# EAGLE board ADK_MEGA_2560-REV3 (EAGLE 7.1.0)
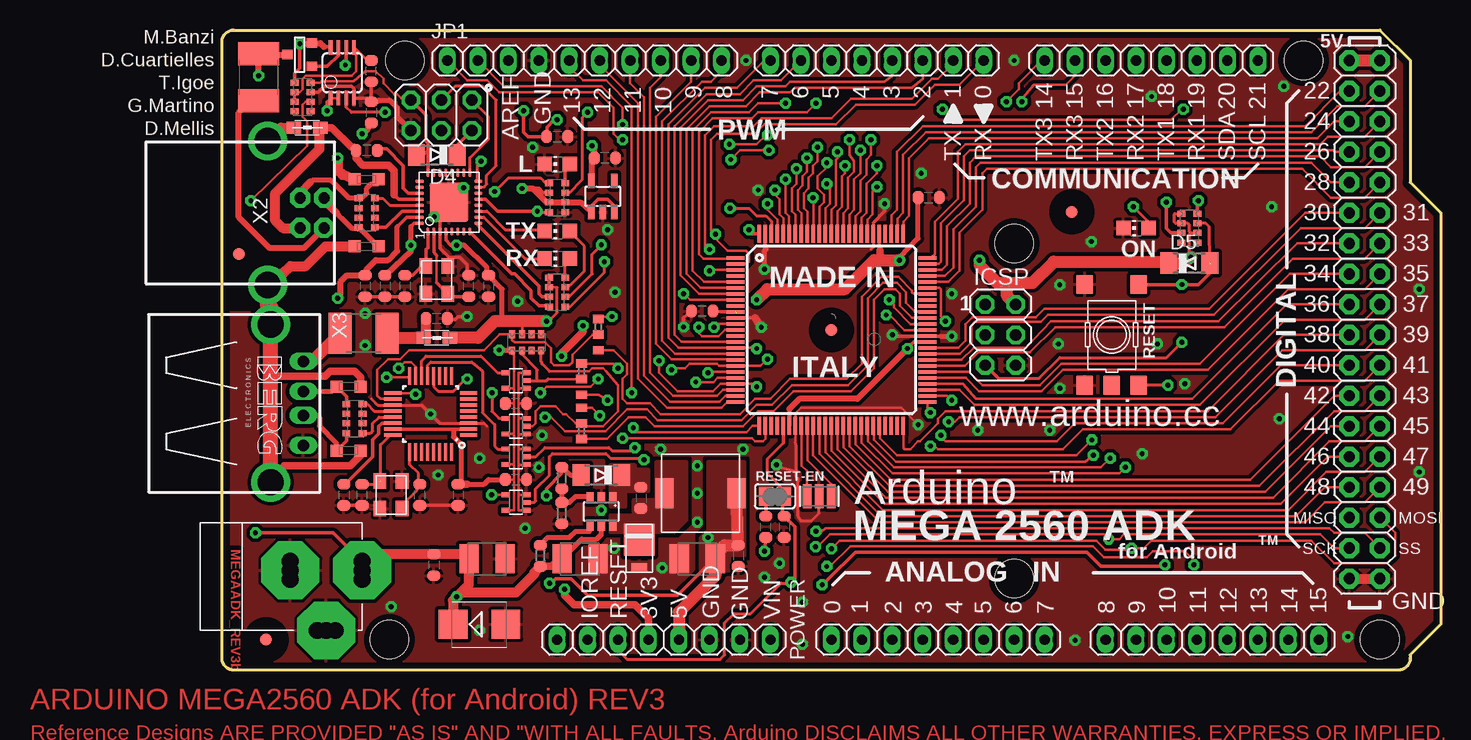
[diagram p2: board, top side]
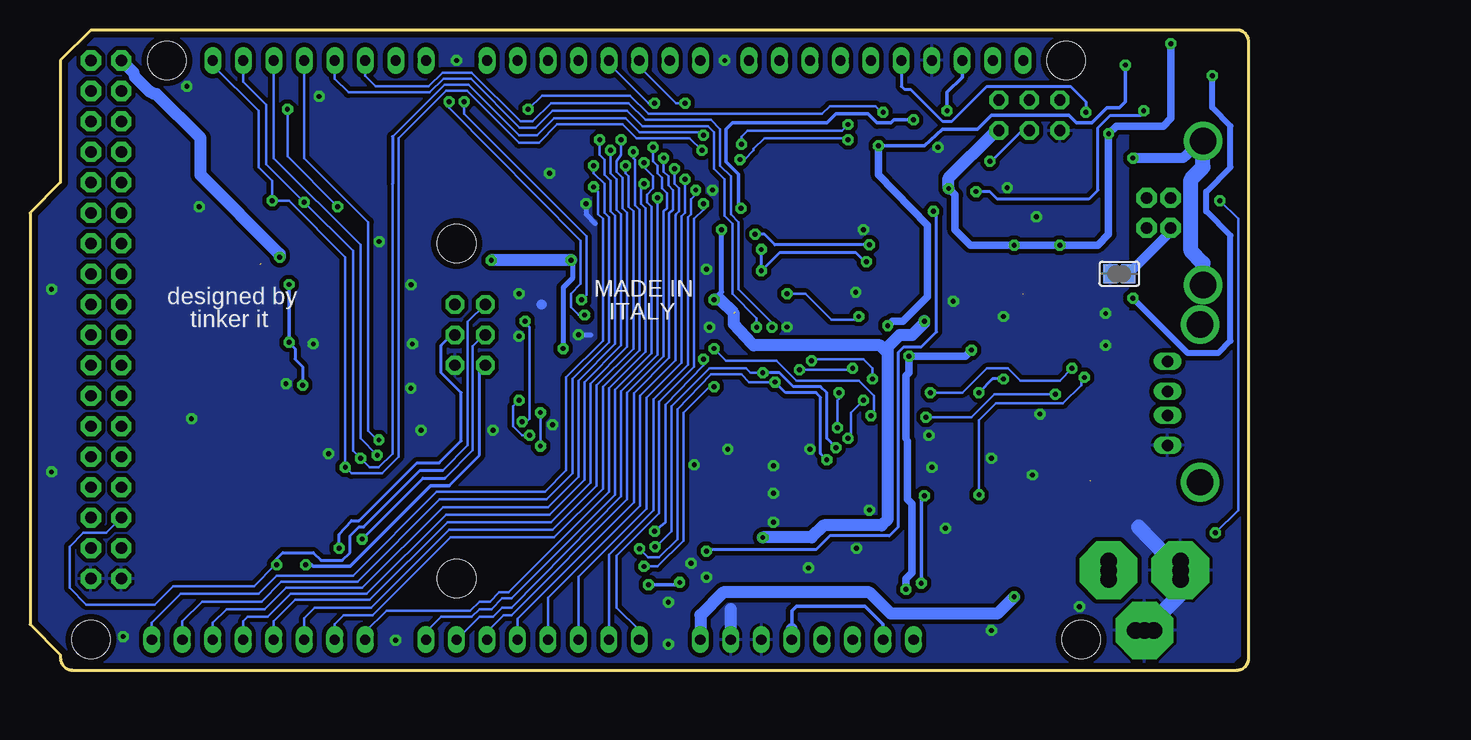
[diagram p3: board, bottom side, seen from below]

Size 101.6 x 53.34 mm. Coordinates in mm from the lower left corner, seen from the top.
Outline: 96.52,53.34 99.06,50.8 99.06,40.64 101.6,38.1 101.6,3.81 99.06,1.27 99.06,1 arc-90 98.06,0 1,0 arc-90 0,1 0,52.34 arc-90 1,53.34 96.52,53.34
Copper layers (1*16): Top 0.035mm / dielectric 1.5mm / Bottom 0.035mm
Design rules "ArduinoMegaHOST *": minimum track width 8mil, minimum drill 16mil, track to track 7mil, track to pad 7mil, pad to pad 7mil, via to via 10mil, smd to smd 7mil, copper to edge 20mil, drill to drill 12mil, minimum pad ring 10mil, minimum via ring 10mil, stop-mask expansion 2mil, vias tented up to drill 20mil, thermal gap 10mil
Net classes: 0 default: width 0.203 mm, drill 0.406 mm, clearance 0.178 mm; 1 power: width 0.305 mm, drill 0.406 mm, clearance 0.178 mm; 2 gnd: width 0.305 mm, drill 0.406 mm, clearance 0.178 mm; 3 power usb: width 0.508 mm, drill 0.406 mm, clearance 0.178 mm
Holes 3.2 mm at 96.52,2.54 15.24,50.8 90.17,50.8 13.97,2.54 66.04,35.56 66.04,7.62

## Footprints (pad centres in the part's own frame; a part is rotated, then mirrored left to right if it is on the bottom)
1X08 = drill 0.85 pad 1.422 long: 1 -8.89,0; 2 -6.35,0; 3 -3.81,0; 4 -1.27,0; 5 1.27,0; 6 3.81,0; 7 6.35,0; 8 8.89,0
C0603-ROUND = smd 0.898 x 1.1: 1 -0.889,0; 2 0.889,0
SMC_B = smd 1.6 x 2.4: + -1.5,0; - 1.5,0
MINIMELF = smd 1.4 x 1.8: A 1.7,0; C -1.7,0
SMB = smd 2.4 x 2.4: A 2.2,0; C -2.2,0
DO220AAL = smd 2.667 x 2.54: P$1 -0.7,0 | smd 0.762 x 1.27: P$2 1.65,0
L1812 = smd 1.9 x 3.4: 1 -1.95,0; 2 1.95,0
FIDUCIA-MOUNT = smd 1.016 x 1.016: P$1 0,0
SJ = smd 1.168 x 1.6: 1 -0.762,0; 2 0.762,0
MSOP08 = smd 0.3 x 1.2: 1 -0.976,-2.113; 2 -0.326,-2.113; 3 0.324,-2.113; 4 0.974,-2.113; 5 0.974,2.112; 6 0.324,2.112; 7 -0.326,2.112; 8 -0.976,2.112
SOT23-6 = smd 0.6 x 0.9: 1 -0.95,-1.15; 2 0,-1.15; 3 0.95,-1.15; 4 0.95,1.15; 5 0,1.15; 6 -0.95,1.15
TQFP100 = smd 1.5 x 0.3: 1 -8,6; 2 -8,5.5; 3 -8,5; 4 -8,4.5; 5 -8,4; 6 -8,3.5; 7 -8,3; 8 -8,2.5; 9 -8,2; 10 -8,1.5; 11 -8,1; 12 -8,0.5; 13 -8,0; 14 -8,-0.5; 15 -8,-1; 16 -8,-1.5; 17 -8,-2; 18 -8,-2.5; 19 -8,-3; 20 -8,-3.5; 21 -8,-4; 22 -8,-4.5; 23 -8,-5; 24 -8,-5.5; 25 -8,-6; 51 8,-6; 52 8,-5.5; 53 8,-5; 54 8,-4.5; 55 8,-4; 56 8,-3.5; 57 8,-3; 58 8,-2.5; 59 8,-2; 60 8,-1.5; 61 8,-1; 62 8,-0.5; 63 8,0; 64 8,0.5; 65 8,1; 66 8,1.5; 67 8,2; 68 8,2.5; 69 8,3; 70 8,3.5; 71 8,4; 72 8,4.5; 73 8,5; 74 8,5.5; 75 8,6 | smd 0.3 x 1.5: 26 -6,-8; 27 -5.5,-8; 28 -5,-8; 29 -4.5,-8; 30 -4,-8; 31 -3.5,-8; 32 -3,-8; 33 -2.5,-8; 34 -2,-8; 35 -1.5,-8; 36 -1,-8; 37 -0.5,-8; 38 0,-8; 39 0.5,-8; 40 1,-8; 41 1.5,-8; 42 2,-8; 43 2.5,-8; 44 3,-8; 45 3.5,-8; 46 4,-8; 47 4.5,-8; 48 5,-8; 49 5.5,-8; 50 6,-8; 76 6,8; 77 5.5,8; 78 5,8; 79 4.5,8; 80 4,8; 81 3.5,8; 82 3,8; 83 2.5,8; 84 2,8; 85 1.5,8; 86 1,8; 87 0.5,8; 88 0,8; 89 -0.5,8; 90 -1,8; 91 -1.5,8; 92 -2,8; 93 -2.5,8; 94 -3,8; 95 -3.5,8; 96 -4,8; 97 -4.5,8; 98 -5,8; 99 -5.5,8; 100 -6,8
MLF32 = smd 0.7 x 0.28: 1 -2.45,1.75; 2 -2.45,1.25; 3 -2.45,0.75; 4 -2.45,0.25; 5 -2.45,-0.25; 6 -2.45,-0.75; 7 -2.45,-1.25; 8 -2.45,-1.75; 17 2.45,-1.75; 18 2.45,-1.25; 19 2.45,-0.75; 20 2.45,-0.25; 21 2.45,0.25; 22 2.45,0.75; 23 2.45,1.25; 24 2.45,1.75 | smd 0.28 x 0.7: 9 -1.75,-2.45; 10 -1.25,-2.45; 11 -0.75,-2.45; 12 -0.25,-2.45; 13 0.25,-2.45; 14 0.75,-2.45; 15 1.25,-2.45; 16 1.75,-2.45; 25 1.75,2.45; 26 1.25,2.45; 27 0.75,2.45; 28 0.25,2.45; 29 -0.25,2.45; 30 -0.75,2.45; 31 -1.25,2.45; 32 -1.75,2.45 | smd 3.254 x 3.254: 33 0,0
SC70-5 = smd 0.4 x 0.7: 1 -0.65,-0.85; 2 0,-0.85; 3 0.65,-0.85; 4 0.65,0.85; 5 -0.65,0.85
SOT23-DBV = smd 0.55 x 1.2: 1 -0.95,-1.3; 2 0,-1.3; 3 0.95,-1.3; 4 0.95,1.3; 5 -0.95,1.3
2X03 = drill 0.95 pad 1.55 octagon: 1 -2.54,-1.27; 2 -2.54,1.27; 3 0,-1.27; 4 0,1.27; 5 2.54,-1.27; 6 2.54,1.27
1X10 = drill 0.85 pad 1.422 long: 1 -11.43,0; 2 -8.89,0; 3 -6.35,0; 4 -3.81,0; 5 -1.27,0; 6 1.27,0; 7 3.81,0; 8 6.35,0; 9 8.89,0; 10 11.43,0
CHIP-LED0805 = smd 1.2 x 1.2: A 0,-1.05; C 0,1.05
SRR0604 = smd 1.5 x 2.5: P$1 3,0; P$2 -3,0
0805 = smd 1.2 x 1: 1 -1.1,0; 2 1.1,0
R0603-ROUND = smd 0.898 x 1.1: 1 -0.889,0; 2 0.889,0
R0402 = smd 0.7 x 0.9: 1 -0.65,0; 2 0.65,0
TS42 = smd 1.6 x 1.4: 1 -4.2,2.25; 2 4.2,2.25; 3 -4.2,-2.25; 4 4.2,-2.25; 5 -4.2,0
CAT16 = smd 0.5 x 0.65: 1 -1.2,-0.675; 2 -0.4,-0.675; 3 0.4,-0.675; 4 1.2,-0.675; 5 1.2,0.675; 6 0.4,0.675; 7 -0.4,0.675; 8 -1.2,0.675
CAY16 = smd 0.5 x 0.65: 1 -1.2,-0.675; 2 -0.4,-0.675; 3 0.4,-0.675; 4 1.2,-0.675; 5 1.2,0.675; 6 0.4,0.675; 7 -0.4,0.675; 8 -1.2,0.675
J0402 = smd 0.7 x 0.9: 1 -0.65,0; 2 0.65,0; 3 1.95,0
SOT-23 = smd 0.787 x 0.889: 1 0.025,-1.016; 2 -0.94,1.016; 3 0.991,1.016
TQFP32-05 = smd 0.27 x 1.45: 1 -1.75,-3.16; 2 -1.25,-3.16; 3 -0.75,-3.16; 4 -0.25,-3.16; 5 0.25,-3.16; 6 0.75,-3.16; 7 1.25,-3.16; 8 1.75,-3.16; 17 1.75,3.16; 18 1.25,3.16; 19 0.75,3.16; 20 0.25,3.16; 21 -0.25,3.16; 22 -0.75,3.16; 23 -1.25,3.16; 24 -1.75,3.16 | smd 1.45 x 0.27: 9 3.16,-1.75; 10 3.16,-1.25; 11 3.16,-0.75; 12 3.16,-0.25; 13 3.16,0.25; 14 3.16,0.75; 15 3.16,1.25; 16 3.16,1.75; 25 -3.16,1.75; 26 -3.16,1.25; 27 -3.16,0.75; 28 -3.16,0.25; 29 -3.16,-0.25; 30 -3.16,-0.75; 31 -3.16,-1.25; 32 -3.16,-1.75
POWERSUPPLY_DC-21MM = drill 1.4 pad 4.826 octagon: 1 -5.08,-3.353; 2 -0.076,-6.35; 3 -0.076,-0.356 | drill 1.4: 4 -5.08,-4.115; 5 -5.08,-2.591; 6 -0.838,-0.356; 7 0.686,-0.356; 8 -0.838,-6.35; 9 0.686,-6.35
PN61729 = drill 0.95 pad 1.676 octagon: 1 1.25,4.71; 2 -1.25,4.71; 3 -1.25,2.71; 4 1.25,2.71 | drill 2.2: P$1 -6,0; P$2 6,0
PN87520-S = drill 0.95 long: 1 -3.5,2.71; 2 -1,2.71; 3 1,2.71; 4 3.5,2.71 | drill 2.2 pad 2.9: S1 -6.57,0; S2 6.57,0
2X18 = drill 0.95 pad 1.676 octagon: 1 -21.59,-1.27; 2 -21.59,1.27; 3 -19.05,-1.27; 4 -19.05,1.27; 5 -16.51,-1.27; 6 -16.51,1.27; 7 -13.97,-1.27; 8 -13.97,1.27; 9 -11.43,-1.27; 10 -11.43,1.27; 11 -8.89,-1.27; 12 -8.89,1.27; 13 -6.35,-1.27; 14 -6.35,1.27; 15 -3.81,-1.27; 16 -3.81,1.27; 17 -1.27,-1.27; 18 -1.27,1.27; 19 1.27,-1.27; 20 1.27,1.27; 21 3.81,-1.27; 22 3.81,1.27; 23 6.35,-1.27; 24 6.35,1.27; 25 8.89,-1.27; 26 8.89,1.27; 27 11.43,-1.27; 28 11.43,1.27; 29 13.97,-1.27; 30 13.97,1.27; 31 16.51,-1.27; 32 16.51,1.27; 33 19.05,-1.27; 34 19.05,1.27; 35 21.59,-1.27; 36 21.59,1.27
RESONATOR = smd 0.7 x 2: 1 -1,0; 2 0,0; 3 1,0
CRYSTAL-3.2-2.5 = smd 1.3 x 1.05: 1 -1.15,-0.925; 2 1.15,-0.925; 3 1.15,0.925; 4 -1.15,0.925
CT/CN0603 = smd 1 x 1: 1 -1,0; 2 1,0

## Placement (x,y rotation side)
ADCH  8x1F-H8.5  [1X08]  82.55,2.54 0 top
ADCL  8x1F-H8.5  [1X08]  59.69,2.54 0 top
C1  22p  [C0603-ROUND]  46.86,11.94 270 top
C2  10n  [C0603-ROUND]  34.92,14.35 270 top
C3  100n  [C0603-ROUND]  17.65,8.76 270 top
C4  10u  [SMC_B]  29.84,9.27 0 top
C5  10u  [SMC_B]  39.62,9.27 180 top
C6  100n  [C0603-ROUND]  27.94,44.45 0 top
C7  100n  [C0603-ROUND]  43.05,9.53 270 top
C8  100n  [C0603-ROUND]  58.93,39.37 0 top
C9  100n  [C0603-ROUND]  40.05,29.91 180 top
C10  100n  [C0603-ROUND]  45.34,11.94 90 top
C11  100n  [C0603-ROUND]  11.94,32 270 top
C12  22p  [C0603-ROUND]  20.57,32 90 top
C13  22p  [C0603-ROUND]  15.24,32 270 top
C14  100n  [C0603-ROUND]  22.23,32 270 top
C15  100n  [C0603-ROUND]  13.59,32 270 top
C16  1u  [C0603-ROUND]  12.06,43.31 180 top
C17  100n  [C0603-ROUND]  17.91,29.31 0 top
C18  100n  [C0603-ROUND]  19.68,14.61 270 top
C19  22p  [C0603-ROUND]  16.51,14.61 90 top
C20  22p  [C0603-ROUND]  11.68,14.61 90 top
C21  100n  [C0603-ROUND]  12.45,46.48 270 top
C22  100n  [C0603-ROUND]  12.45,49.91 90 top
C23  1u  [C0603-ROUND]  31.93,42.67 180 top
C24  100n  [C0603-ROUND]  10.16,14.61 270 top
C25  100n  [C0603-ROUND]  24.51,22.23 0 top
C26  100n  [C0603-ROUND]  24.51,15.88 0 top
COMMUNICATION  8x1F-H8.5  [1X08]  77.47,50.8 180 top
D1  CD1206-S01575  [MINIMELF]  31.62,16.26 180 top
D2  M7  [SMB]  21.46,3.81 0 top
D3  SS1P3L  [DO220AAL]  34.8,10.16 270 top
D4  CD1206-S01575  [MINIMELF]  17.91,42.93 180 top
D5  CD1206-S01575  [MINIMELF]  80.64,33.91 0 top
F1  MF-MSMF050-2 500mA  [L1812]  3.05,49.4 270 top
F2  MF-MSMF050-2 500mA  [L1812]  11.81,28.07 180 top
FID1  FIDUCIALMOUNT  [FIDUCIA-MOUNT]  1.4,34.67 0 top
FID2  FIDUCIALMOUNT  [FIDUCIA-MOUNT]  70.84,38.19 0 top
FID3  FIDUCIALMOUNT  [FIDUCIA-MOUNT]  50.8,28.35 0 top
FID4  FIDUCIALMOUNT  [FIDUCIA-MOUNT]  3.68,2.54 0 top
GROUND  [SJ]  10.79,33.02 180 bottom
IC1  LMV358IDGKR  [MSOP08]  10.03,49.78 0 top
IC2  LM2734Y  [SOT23-6]  31.62,13.21 180 top
IC3  ATMEGA2560-16AU  [TQFP100]  50.8,28.35 0 top
IC4  ATMEGA16U2-MUR  [MLF32]  18.92,38.99 90 top
IC5  74LVC1G125DCK  [SC70-5]  24.51,20.32 90 top
IC6  74LVC1G125DCK  [SC70-5]  24.51,17.78 90 top
IC7  LP2985-33DBVR  [SOT23-DBV]  31.75,39.47 0 top
IC8  74LVC1G125DCK  [SC70-5]  24.51,24.13 90 top
IC9  74LVC1G125DCK  [SC70-5]  24.51,13.97 90 top
ICSP  3x2M  [2X03]  64.9,27.94 270 top
ICSP1  3x2M  [2X03]  18.29,46.23 180 top
JP1  10x1F-H8.5  [1X10]  30.23,50.8 0 top
L  YELLOW  [CHIP-LED0805]  27.94,42.16 90 top
L1  10u SRR0604-100ML  [SRR0604]  39.88,14.73 180 top
L2  MH2029-300Y  [0805]  7.11,45.21 180 top
L3  MH2029-300Y  [0805]  17.91,27.69 180 top
ON  GREEN  [CHIP-LED0805]  76.2,36.83 90 top
PC1  10u  [SMC_B]  22.1,9.27 0 top
POWER  8x1F-H8.5  [1X08]  36.83,2.54 0 top
PWML  8x1F-H8.5  [1X08]  54.61,50.8 180 top
R1  100k  [R0603-ROUND]  26.54,9.53 90 top
R2  52K3  [R0603-ROUND]  28.32,16 270 top
R3  10K  [R0603-ROUND]  28.32,13.08 270 top
R5  0R  [R0402]  29.97,24.89 90 top
R6  0R  [R0402]  29.97,19.91 90 top
R9  0R  [R0402]  31.37,28.57 90 top
RESET  TS42  [TS42]  74.17,27.94 90 top
RESET-EN  [SJ]  46.1,14.48 180 top
RN1  10K  [CAT16]  80.64,36.83 270 top
RN2  1k  [CAY16]  27.94,39.37 270 top
RN3  10K  [CAT16]  6.73,47.75 270 top
RN4  22R  [CAY16]  12.06,38.1 90 top
RN5  1k  [CAY16]  27.94,31.5 90 top
RN6  10K  [CAT16]  25.4,27.3 0 top
RN7  22R  [CAY16]  11.05,20.95 270 top
RX  YELLOW  [CHIP-LED0805]  27.94,34.29 90 top
SJ1  NM  [J0402]  29.97,21.21 270 top
SJ2  NM  [J0402]  29.97,23.6 90 top
SJ3  NM  [J0402]  31.37,27.3 90 top
T1  FDN340P  [SOT-23]  6.48,51.31 270 top
TX  YELLOW  [CHIP-LED0805]  27.94,36.58 90 top
U7A  MAX3421EEHJ  [TQFP32-05]  17.4,21.34 90 top
X1  JACK 2mm  [POWERSUPPLY_DC-21MM]  5.33,8.38 90 top
X2  USB B-TH  [PN61729]  3.81,38.1 270 top
X3  USB A-TH  [PN87520-S]  4.06,22.23 270 top
XIO  18x2F-H8.5  [2X18]  95.25,29.21 270 top
Y1  16MHz CSTCE16M0V53-R0  [RESONATOR]  49.78,14.48 0 top
Y2  16MHz KX-7  [CRYSTAL-3.2-2.5]  17.91,32.51 270 top
Y3  12MHz KX-7  [CRYSTAL-3.2-2.5]  14.1,14.61 270 top
Z1  CG0603MLC-05E  [CT/CN0603]  12.06,35.31 0 top
Z2  CG0603MLC-05E  [CT/CN0603]  12.06,40.89 0 top
Z3  CG0603MLC-05E  [CT/CN0603]  10.54,18.29 180 top
Z4  CG0603MLC-05E  [CT/CN0603]  10.54,23.62 180 top

## Tracks (layer width: path | path; a pad name or v marks a point on that pad's centre or on a via)
+3V3  (via drill 0.41)
  Top 0.203: 24.33,22.23 C25.1 | 24.33,22.23 24.33,23.48 | 24.33,23.48 IC8.5 | C26.1 24.33,15.88 | IC9.5 24.33,13.32 24.33,15.88 | RN6.1 24.2,26.35 24.33,26.21 24.33,23.48 | 24.33,15.88 24.33,17.14 | 24.33,17.14 24.33,19.68 | 24.33,19.68 24.33,22.23 | IC5.5 23.68,19.68 24.33,19.68 | IC6.5 23.68,17.14 24.33,17.14
  Top 0.305: IC1.6 10.36,50.67 v10.29,50.42 | U7A.23 19.3,20.09 | 19.3,20.09 U7A.2 | 19.3,20.09 19.3,19.96
  Top 0.406: C18.1 19.94,15.75 19.94,18.8 19.3,19.43 19.3,19.96 | C26.1 22.23,15.88 21.84,15.49 20.45,15.49 | v23.11,26.67 23.15,26.63 RN6.1
  Top 0.508: v30.86,43.69 30.99,43.54 31.04,43.33 C23.2 30.8,42.69 IC7.5
  Top 0.61: C18.1 20.45,15.49 | v28.32,26.16 28.32,26.42 30.1,28.19 v30.1,28.7 | POWER.4 35.56,4.32 34.42,5.46 29.34,5.46 28.57,6.22 v28.57,6.73
  Bottom 0.305: v10.29,50.42 10.29,47.37 10.79,46.86 11.81,46.86 13.08,45.59 14.35,45.59 14.99,46.23 21.46,46.23 22.61,45.09 25.53,45.09 27.05,43.69 v30.86,43.69
  Bottom 0.61: v23.11,26.67 23.62,26.16 v28.32,26.16 28.32,24.77 28.57,24.51 28.57,19.3 28.45,19.05 28.45,14.22 28.07,13.84 28.07,8.13 28.57,7.62 v28.57,6.73 | v30.1,28.7 29.72,29.08 28.83,29.08 26.8,31.11 26.8,37.08 30.86,41.27 v30.86,43.69
+5V  (via drill 0.41)  (1 unrouted)
  Top 0.203: T1.2 6.78,52.25 | IC7.1 30.81,38.31
  Top 0.254: IC3.80 54.81,36.3 54.79,36.27 54.81,36.25 54.81,35.41 | 57.66,27.3 57.7,27.35 | v27.05,29.08 27.24,29.08 27.94,29.78 27.94,31.88 27.41,31.9 RN5.6 RN5.5 | RN6.7 25,28.81 25.27,29.08 | 80.75,36.43 RN1.6 | 80.75,36.43 80.64,36.32 80.64,34.8 v80.77,34.42 | 80.75,36.43 80.64,36.54 80.64,37.08 80.5,37.23 RN1.2 79.48,37.23 79.38,37.34 79.38,37.97 79.43,38.03 RN1.1
  Top 0.305: 54.86,34.92 54.86,35.1 54.81,35.15 54.81,35.41 | 57.7,27.35 IC3.61 | v57.15,26.8 57.66,27.3 | IC3.100 44.17,36.35 v43.94,36.7 | IC3.10 41.59,29.85 C9.1 | 6.78,52.25 6.48,51.94 6.48,50.16 6.06,49.74 RN3.1 | 8.51,51.94 9.01,51.94 IC1.8 | IC4.32 16.03,37.24 15.75,36.96 | IC4.4 18.67,35.81 19.07,35.41 v19.56,35.41 | IC7.3 32.7,38.67 32.13,39.24 31.37,39.24 30.81,38.68 30.81,38.31 | RN2.2 26.78,39.77 26.42,40.13 25.91,40.13 | C5.+ 40.74,8.99 37.97,6.22 30.48,6.22 29.08,7.62 27.81,7.62 27.43,7.24 v27.3,7.24 | v27.05,14.53 27.05,15.11 28.32,16.38 R2.1 | D4.C 19.61,43.74 ICSP1.2
  Top 0.356: 47.3,21.77 IC3.31
  Top 0.406: C8.1 58.04,35.97 56.52,34.42 56.49,34.39 v56.49,34.16 | v11.68,44.7 11.81,44.7 12.19,45.09 12.19,45.34 C21.2 | 15.75,34.92 v15.75,35.41 15.75,36.96 | v19.56,35.41 20.17,35.41 22.1,33.53 22.1,32.89 C14.1 23.37,31.75 23.37,29.08 | D1.A 29.08,16.26 R2.1
  Top 0.508: 47.3,21.77 48.13,22.61 52.96,22.61 v57.15,26.8 | v6.5,52.2 T1.2 8.2,52.25 8.51,51.94 | IC7.1 29.88,38.97 RN2.6 RN2.3 27.07,38.97 25.91,40.13 v25.02,40.13 | 15.75,34.92 C15.1
  Top 0.61: 54.86,34.29 54.86,34.92
  Top 1.016: POWER.5 38.1,4.83 41.12,7.85 C5.+ | XIO.1 XIO.2 | 65.41,32.26 64.64,32.26 63.14,33.76 v63.14,34.14 | 65.41,32.26 65.41,31.24 ICSP.2 | 65.41,32.26 67.56,32.26 69.34,34.04 78.82,34.04 D5.C 80.14,33.91 v80.77,34.42 | 54.99,34.16 54.36,34.16 51.94,31.75 45.47,31.75 v44.58,30.86 | 54.99,34.16 v56.49,34.16 | 54.99,34.16 54.86,34.29 | L3.1 21.34,27.69 22.73,29.08 23.37,29.08 25.27,29.08 v27.05,29.08 | 41.25,10.06 41.38,9.76 41.91,10.41 C7.1 43.01,10.97 L1.P$2
  Bottom 0.305: v27.3,7.24 27.3,14.48 v27.05,14.53 | POWER.2 30.48,3.81 32,5.33 37.72,5.33 38.1,4.95 POWER.5
  Bottom 0.406: v43.94,36.7 43.94,31.5 v44.58,30.86 44.58,30.73 44.55,30.7 | 56.77,34.16 v56.49,34.16 56.39,34.06 56.39,32.64 57.15,31.88 v57.15,26.8
  Bottom 0.61: 63.12,34.16 v63.14,34.14 | v25.02,40.13 24.49,39.6 24.49,36.68 23.22,35.41 v19.56,35.41 v15.75,35.41 12.6,35.41 11.68,36.32 v11.68,44.7 11.05,45.34 7.11,45.34 6.48,45.97 6.48,52.07 v6.5,52.2
  Bottom 1.016: POWER.5 38.1,3.43 | v56.49,34.16 63.12,34.16 | ICSP1.2 20.95,44.83 21.21,44.83 25.02,41.02 v25.02,40.13 | XIO.1 92.96,49.78 92.84,49.4 91.69,48.26 91.19,48.01 91.06,48.01 87.38,44.32 87.38,41.27 80.77,34.67 v80.77,34.42 | 30.1,26.42 30.73,27.05 41.27,27.05 41.4,27.18 42.93,28.83 42.93,29.72 44.07,30.86 v44.58,30.86 | 30.1,26.42 30.1,26.94 29.1,27.94 28.05,27.94 27.05,28.94 v27.05,29.08 | 30.1,26.42 30.1,12.57 30.61,12.06 35.43,12.06 36.45,11.05 v40.51,11.05
  pour Top (no thermals): 40.51,17.4 43.56,17.4 43.56,9.53 42.29,9.53 42.29,8.26 39.88,8.26 39.88,11.05 40.51,11.68
ADC0  (via drill 0.41)
  Top 0.203: IC3.97 46.3,37.52 45.47,38.35 v45.47,38.86
  Bottom 0.203: ADCL.1 50.8,3.3 52.7,5.21 52.7,9.53 49.15,13.08 49.15,22.35 46.23,25.27 46.23,37.59 45.47,38.35 v45.47,38.86
ADC1  (via drill 0.41)
  Top 0.203: IC3.96 46.8,37.66 46.48,37.97 46.48,39.24 46.1,39.62 v46.1,40.01
  Bottom 0.203: ADCL.2 53.34,9.6 49.63,13.31 49.63,22.55 46.74,25.45 46.74,37.72 46.48,37.97 46.48,39.24 46.1,39.62 v46.1,40.01
ADC2  (via drill 0.41)
  Top 0.203: v46.99,40.89 46.99,38.1 47.27,37.82 47.27,36.68 47.37,36.58 47.3,36.51 47.3,36.38 47.27,36.35 | 47.27,36.35 47.24,36.32 | 47.27,36.35 IC3.95
  Bottom 0.203: ADCL.3 55.88,7.8 50.22,13.46 50.22,22.68 47.27,25.63 47.27,37.82 46.99,38.1 v46.99,40.89
ADC3  (via drill 0.41)
  Top 0.203: IC3.94 47.8,37.92 47.5,38.23 47.5,40.13 47.88,40.51 v47.88,41.78
  Bottom 0.203: ADCL.4 58.42,2.74 58.52,2.85 58.52,3.05 58.42,3.15 58.42,6.02 50.75,13.69 50.75,22.86 47.8,25.81 47.8,37.85 47.75,37.97 47.5,38.23 47.5,40.13 47.88,40.51 v47.88,41.78
ADC4  (via drill 0.41)
  Top 0.203: IC3.93 48.3,38.06 48.01,38.35 48.01,40.01 48.39,40.39 48.39,41.15 48.77,41.53 v48.77,42.67
  Bottom 0.203: 60.96,2.44 ADCL.5 60.96,4.27 51.26,13.97 51.26,23.06 48.31,26.01 48.31,38.05 48.01,38.35 48.01,40.01 48.39,40.39 48.39,41.15 48.77,41.53 v48.77,42.67
ADC5  (via drill 0.41)
  Top 0.203: IC3.92 48.8,38.2 48.51,38.48 48.51,39.75 48.9,40.13 48.9,41.02 49.28,41.4 49.28,42.04 49.66,42.42 v49.66,43.56
  Bottom 0.203: v49.66,43.56 49.66,42.42 49.28,42.04 49.28,41.4 48.9,41.02 48.9,40.13 48.51,39.75 48.51,38.48 48.77,38.23 48.77,26.16 51.82,23.11 51.82,14.22 61.47,4.57 62.1,4.57 63.5,3.17 ADCL.6
ADC6  (via drill 0.41)
  Top 0.203: IC3.91 49.3,39.35 v49.28,39.37
  Bottom 0.203: v49.28,39.37 49.28,26.29 52.32,23.24 52.32,14.48 61.47,5.21 62.23,5.21 62.99,4.45 64.14,4.45 ADCL.7
ADC7  (via drill 0.41)
  Top 0.203: IC3.90 49.8,38.62 50.16,38.99 50.16,39.62 49.66,40.13 49.66,41.15 50.42,41.91 v50.42,42.29
  Bottom 0.203: v50.42,42.29 50.42,41.91 49.66,41.15 49.66,40.13 50.16,39.62 50.16,38.99 49.78,38.61 49.78,26.42 52.83,23.37 52.83,14.61 61.47,5.97 62.23,5.97 63.12,5.08 64.14,5.08 64.77,4.45 67.31,4.45 68.58,3.17 ADCL.8
ADC8  (via drill 0.41)
  Top 0.203: IC3.89 50.3,38.49 50.67,38.86 50.67,40.26 v50.42,40.51
  Bottom 0.203: v50.42,40.51 50.67,40.26 50.67,38.86 50.29,38.48 50.29,26.54 53.34,23.5 53.34,14.86 61.72,6.48 62.48,6.48 63.25,5.71 64.14,5.71 64.9,4.95 71.88,4.95 73.66,3.17 ADCH.1
ADC9  (via drill 0.41)
  Top 0.203: IC3.88 50.8,38.35 51.18,38.73 51.18,42.55 51.31,42.67 v51.31,43.18
  Bottom 0.203: v51.31,43.18 51.31,42.67 51.18,42.55 51.18,38.73 50.8,38.35 50.8,26.67 53.85,23.62 53.85,15.11 57.91,11.05 66.55,11.05 73.03,4.57 75.44,4.57 76.2,3.81 ADCH.2
ADC10  (via drill 0.41)
  Top 0.203: IC3.87 51.3,38.22 51.69,38.61 51.69,41.15 51.94,41.4 v51.94,42.04
  Bottom 0.203: v51.94,42.04 51.94,41.4 51.69,41.15 51.69,38.61 51.31,38.23 51.31,26.8 54.36,23.75 54.36,15.37 58.04,11.68 66.67,11.68 73.15,5.21 77.85,5.21 78.74,4.32 ADCH.3
ADC11  (via drill 0.41)
  Top 0.203: IC3.86 51.8,38.08 52.2,38.48 52.2,41.02 52.7,41.53 52.7,42.42 52.32,42.93 v52.32,44.2
  Bottom 0.203: v52.32,44.2 52.32,42.93 52.7,42.42 52.7,41.53 52.2,41.02 52.2,38.48 51.82,38.1 51.82,26.92 54.86,23.88 54.86,15.62 58.17,12.32 66.8,12.32 73.28,5.84 79.5,5.84 81.28,4.06 ADCH.4
ADC12  (via drill 0.41)
  Top 0.203: IC3.85 52.3,37.95 52.7,38.35 52.7,40.89 53.21,41.4 v53.21,43.31
  Bottom 0.203: v53.21,43.31 53.21,41.4 52.7,40.89 52.7,38.35 52.32,37.97 52.32,27.05 55.37,24 55.37,15.88 58.29,12.95 66.93,12.95 73.53,6.35 79.88,6.35 81.79,4.45 83.44,4.45 83.82,4.06 ADCH.5
ADC13  (via drill 0.41)
  Top 0.203: IC3.84 52.8,37.81 53.21,38.23 53.21,40.77 53.72,41.27 53.72,42.55 54.1,42.93 v54.1,44.2
  Bottom 0.203: v54.1,44.2 54.1,42.93 53.72,42.55 53.72,41.27 53.21,40.77 53.21,38.23 52.83,37.85 52.83,27.18 55.88,24.13 55.88,16.13 58.42,13.59 67.18,13.59 73.91,6.86 80.26,6.86 82.04,5.08 85.22,5.08 86.36,3.94 ADCH.6
ADC14  (via drill 0.41)
  Top 0.203: IC3.83 53.3,37.68 53.72,38.1 53.72,40.51 54.61,41.4 v54.61,42.04
  Bottom 0.203: v54.61,42.04 54.61,41.4 53.72,40.51 53.72,38.1 53.34,37.72 53.34,27.3 56.39,24.26 56.39,16.38 58.55,14.22 67.44,14.22 74.3,7.37 80.64,7.37 82.3,5.71 87.25,5.71 88.9,4.06 ADCH.7
ADC15  (via drill 0.41)
  Top 0.203: IC3.82 53.8,37.54 54.23,37.97 54.23,39.88 v54.61,40.26
  Bottom 0.203: v54.61,40.26 54.23,39.88 54.23,37.97 53.85,37.59 53.85,27.43 56.9,24.38 56.9,16.64 58.67,14.86 67.69,14.86 74.68,7.87 81.03,7.87 82.55,6.35 89.03,6.35 91.44,3.94 ADCH.8
AREF  (via drill 0.41)
  Top 0.254: IC3.98 45.8,37.38 45.34,37.85 44.58,37.85 43.94,38.48 v42.34,38.48
  Top 0.305: v25.15,46.61 25.15,44.83 25.53,44.45 C6.1 27.09,45.09 27.09,45.25 27.69,45.85 v27.94,45.85
  Bottom 0.305: v27.94,45.85 29.59,45.85 29.84,45.59 30.99,45.59 31.75,46.35 34.42,46.35 35.18,45.59 43.05,45.59 43.56,45.09 43.56,42.34 42.55,41.33 42.55,38.73 v42.34,38.48 | v25.15,46.61 25.15,48.13 23.88,49.4 JP1.3
BOOST
  pour Top (no thermals): 32.38,13.59 32.38,17.14 34.42,17.14 34.42,16.76 35.56,16.76 35.56,14.86 33.66,14.86 33.66,13.59
CMP
  Top 0.203: RN3.3 RN3.2 6.48,48.15 6.73,48.41 6.73,49.28 6.99,49.53 10.79,49.53 11.18,49.91 11.18,51.73 IC1.5 11.01,51.56
  Top 0.254: C22.2 12.1,50.8 IC1.5
D+
  Top 0.406: 7.37,40.64 7.58,40.85 9.06,40.85 10.54,39.37 11.32,39.37 RN4.5 11.61,39.3 12.06,39.75 12.06,40.13 12.45,40.51 12.94,40.51 Z2.2
  Top 0.61: X2.3 6.52,39.79 7.37,40.64
D-
  Top 0.406: 9.53,38.1 9.56,38.1 10.03,37.63 10.03,37.59 10.79,36.83 11.32,36.83 RN4.8 12.73,35.56 Z1.2
  Top 0.61: X2.2 8.53,39.1 9.53,38.1
DTR  (via drill 0.41)
  Top 0.254: RN2.4 26.47,38.17 v26.29,38.23
  Top 0.305: IC4.13 21.98,39.24 22.99,38.23 v26.29,38.23 | v45.21,9.91 C10.1
  Bottom 0.254: v45.21,9.91 44.96,9.91 44.83,10.03 36.07,10.03 34.92,11.18 29.97,11.18 29.21,11.94 29.21,26.48 28.77,26.92 27.3,26.92 26.04,28.19 26.04,37.97 v26.29,38.23
EN
  Top 0.406: IC2.4 30.67,11.62 30.61,11.56 29.46,11.56 28.96,11.05 27.18,11.05 R1.2
FB
  Top 0.406: R2.2 R3.1 28.96,13.97 29.46,14.48 30.55,14.48 IC2.3
GATE_CMD
  Top 0.305: IC1.7 9.71,51.24 8.79,50.32 T1.3
GND  (via drill 0.41)
  Top 0.203: IC8.3 24.71,24.78 24.71,23.48 | 24.71,23.48 IC8.1 | 24.71,22.23 24.71,23.48 | 24.71,22.23 C25.2 | IC5.3 24.78,20.97 24.71,20.95 | 24.71,20.95 24.71,22.23 | IC5.1 24.83,19.67 24.71,19.56 | 24.71,19.56 24.71,20.95 | IC6.3 25.35,18.41 24.71,18.41 | 24.71,18.41 24.71,19.56 | IC6.1 24.83,17.13 24.71,17.02 | 24.71,17.02 24.71,18.41 | 24.71,15.88 C26.2 | 24.71,15.88 24.71,17.02 | IC9.1 24.71,13.32 24.71,14.62 | 24.71,14.62 24.71,15.88 | IC9.3 24.71,14.62 | v58.04,20.45 56.64,21.84 48.26,21.84 47.8,21.39 IC3.32 | IC3.32 | 47.8,18.97 IC3.32 | 54.3,37.28 54.3,36.38 54.33,36.35 | 54.33,36.35 54.36,36.32 | 54.33,36.35 IC3.81 54.3,35.25 54.1,35.05
  Top 0.254: v46.23,17.1 46.4,16.89 47.88,16.51 | 47.8,18.97 47.88,18.67 47.88,16.51 | Y1.2 49.78,13.08 49.15,12.45 48.26,12.45 48.01,12.83 48.01,16 47.88,16.13 47.88,16.51 | 18.15,20.59 U7A.3 21.83,20.59 22.1,20.32 | 16.65,22.09 U7A.19 12.97,22.09 12.45,22.61
  Top 0.305: C24.2 C20.1 | C19.1 C18.2 | 18.15,20.59 v17.4,21.34 16.65,22.09 | C13.2 C15.2 C11.2 | v20.45,29.46 19.68,29.46 19.43,29.21 C17.2 | IC4.33 18.8,37.85 v17.7,37.77 18.17,37.5 IC4.3 18.17,35.17 18.92,34.42 19.81,34.42 20.45,33.78 20.45,33.27 C12.2 | C22.1 C21.1 12.24,47.67 IC1.4 11.01,48.43 10.79,48.64 8.51,48.64 8.02,48.15 RN3.7 | v38.48,28.59 38.48,29.36 C9.2 | 44.42,29.36 44.35,29.36 44.32,29.34 44.32,29.36 | 44.32,29.36 44.4,29.36 | 44.32,29.36 42.88,29.36 42.86,29.35 IC3.11 | IC3.99 45.29,35.2 45.39,35.1 | 58.83,27.84 58.82,27.85 IC3.62 58.81,27.84 | 59.94,27.81 59.92,27.84 58.81,27.84 | 56.06,27.86 56.08,27.84 58.81,27.84 | v55.24,38.86 55.24,38.23 54.3,37.28
  Top 0.406: ICSP1.6 14.61,46.1 14.61,46.86 13.97,47.5 13.08,47.5 12.95,47.37 C21.1 | 45.39,35.1 45.21,34.92 v45.21,33.4 | 59.94,27.81 v60.83,27.81 | v55.88,27.94 56.01,27.81 56.06,27.86
  Top 0.61: 44.42,29.36 v44.96,28.57 | v55.88,27.94 55.88,27.81
  Top 0.813: XIO.35 XIO.36
  Bottom 0.305: GROUND.2 10.16,33.02
  Bottom 0.406: v55.88,27.94 54.86,27.94 | 54.48,37.21 55.24,37.97 v55.24,38.86
  Bottom 0.813: 58.98,30.48 58.93,30.48 | 93.73,7.87 XIO.35
  Bottom 1.016: POWER.7 43.18,5.08
  Bottom 1.27: 9.2,11.94 X1.3 5.69,6.3 X1.1
  other vias: 25.27,11.81 14.11,5.28 18.03,16.26 11.94,27.05 11.94,29.72 21.46,3.3 26.42,16.89 32.69,10.16 31.62,13.34 36.7,8.51 39.62,12.32 39.62,14.73 45.21,7.75 48.39,5.67 48.39,2.16 24.64,30.73 39.62,17.02 36.58,18.41 46.48,8.89 20.14,40.21 43.43,18.41 32.77,31.5 32.13,36.7 25.91,43.56 71.12,2.49 63,20 44.7,40.01 69,20 60.83,31.37 69.85,23.5 76.71,18.04 43.69,50.8 69.72,27.18 58.29,41.4 69.83,32.1 77.98,27.18 80.26,23.88 72.49,35.71 88.14,20.95 99.81,16.51 66.04,50.8 77.5,47.8 87.5,38.61 99.81,31.75 26.67,19.56 93.84,2.79 88.52,48.64 21.46,17.65
  pour Top (isolate 0.305, rank 2): 102.62,52.83 102.62,0.51 1.63,0.63 arc-90 0.64,1.63 0.64,29.84 9.91,29.84 9.91,46.35 0.64,46.35 0.64,51.71 arc-90 1.63,52.71
  pour Bottom (isolate 0.356, rank 2): 103.63,52.83 103.63,0.51 1.27,0.64 0.64,1.27 0.64,29.84 10.03,29.84 10.03,46.35 0.64,46.35 0.64,51.71 arc-90 1.63,52.71
  pour Top (no thermals): 33.02,10.79 33.02,9.02 36.58,9.02 36.58,10.79 39.24,10.79 39.24,8.26 38.48,7.49 30.35,7.49 30.1,7.75 30.1,10.03 30.35,10.29 31.5,10.29 32,10.79
GPX_MAX  (via drill 0.41)
  Top 0.203: IC3.66 57.78,29.85 57.02,30.61 57.02,31.5 56.26,32.26 55.12,32.26 53.85,30.99 53.85,25.4 52.2,23.75 47.5,23.75 45.85,22.1 44.58,22.1 43.31,20.83 36.32,20.83 35.43,21.72 33.78,21.72 31.98,19.91 28.58,19.91 27.42,21.08 v26.92,21.08 | v16.13,22.99 16.03,23.09 U7A.17
  Bottom 0.203: v26.92,21.08 23.11,21.08 21.21,22.99 v16.13,22.99
INT_MAX
  Top 0.203: SJ3.2 30.88,27.95 29.21,26.29 29.21,25.65 28.96,25.4 27.69,25.4 27.43,25.65 27.43,26.82 26.95,27.3 24.38,27.3 24.2,27.5 RN6.8 23.15,27.98 21.84,26.67 15.62,26.67 14.86,25.91 13.84,25.91 12.95,25.02 12.95,22.86 13.21,22.61 14.22,22.61 U7A.18
L13  (via drill 0.41)
  Top 0.203: IC1.1 IC1.2
  Top 0.254: v8.76,46.61 8.76,47.38 IC1.1 | RN2.1 26.99,40.57 26.54,41.02 23.88,41.02 v22.73,39.88
  Bottom 0.254: v22.73,39.88 21.59,39.88 20.95,39.24 13.34,39.24 12.57,40.01 12.57,45.21 11.56,46.23 9.02,46.23 v8.76,46.61
M8RXD
  Top 0.254: RN5.7 27.25,31.11
  Top 0.305: 27.25,31.11 26.67,31.11 26.42,31.37 26.42,32 21.27,37.15 IC4.9
M8TXD
  Top 0.305: RN5.8 27.21,30.35 26.42,30.35 25.78,30.99 25.78,31.62 24.38,33.02 24.13,33.02 20.67,36.48 IC4.8
MISO2
  Top 0.254: IC4.17 20.68,41.4 20.68,42.7 22.23,44.24 22.23,46.1 ICSP1.1
MOSI2  (via drill 0.41)
  Top 0.254: IC4.16 21.27,40.89 21.27,42.1 v21.59,42.42
  Bottom 0.254: ICSP1.4 18.92,44.96 21.46,42.42 v21.59,42.42
MOSI_3V3  (via drill 0.41)
  Top 0.203: IC9.4 22.72,14.62 v22.48,14.61 | v13.72,24.38 15.54,24.38 U7A.16
  Bottom 0.203: v22.48,14.61 22.48,20.83 21.08,22.23 15.49,22.23 13.97,23.75 13.97,24.13 v13.72,24.38
N$2
  Top 0.305: RN2.8 28.61,41.79 L.A
N$3  (via drill 0.41)
  Top 0.203: 77.22,37.08 ON.A | v80.14,46.74 80.01,46.74 79.12,45.85 60.96,45.85 v60.07,46.74
  Top 0.254: RN2.7 28.89,39.75 28.96,39.75 30.05,40.89 30.05,46.05 v30.48,46.48 | 77.22,37.08 77.22,37.37 v75.96,38.62
  Bottom 0.203: v80.14,46.74 80.14,42.8 v75.96,38.62 | v30.48,46.48 30.61,46.48 31.11,46.99 34.92,46.99 35.56,46.35 50.04,46.35 51.56,47.88 58.93,47.88 v60.07,46.74
N$10
  Top 0.305: RN7.1 10.37,22.79 Z4.2
  Top 0.406: X3.2 9.14,23.23 Z4.2
N$11
  Top 0.305: RN7.4 10.37,19.12 Z3.2
  Top 0.406: 6.6,21.23 X3.3 7.99,21.23 8.13,21.08 8.13,20.32 9.53,18.92 Z3.2
N$12
  Top 0.254: U7A.20 12.7,21.59 12.06,22.23 11.79,22.23 RN7.8
N$13
  Top 0.254: U7A.21 13.09,21.09 12.57,20.57 12.57,19.94 12.39,19.75 RN7.5
N$14
  Top 1.016: X3.1 7.52,25.73 F2.2
N$15  (1 unrouted)
  Top 0.254: C20.2 12.94,15.49 | U7A.24 14,19.59 13.21,18.8 13.21,15.77
  Top 0.305: 12.94,15.49 12.94,15.52 Y3.1
N$16
  Top 0.254: U7A.25 15.65,17.12 16.38,16.38 16.38,15.62 C19.2 16.26,15.24 16.26,14.99 15,13.73 15,13.48
  Top 0.305: Y3.3 15,13.48
N$18
  Top 0.813: 17.02,27.77 C17.1
  Top 1.016: F2.1 14.27,27.69 L3.2 17.02,27.77
N$39
  Top 0.305: U7A.22 13.35,20.59 13.08,20.32 13.08,19.68 12.57,19.18 12.57,17.78 10.41,15.62 10.29,15.49 C24.1
N$54
  Top 0.254: RN5.4 28.61,33.82 RX.A
N$55
  Top 0.254: RN5.3 28.85,31.9 30.23,33.27 30.23,35.31 TX.A
PA0
  Top 0.203: IC3.78 55.8,37.89 56.26,38.35 56.26,43.18 58.42,45.34 90.3,45.34 93.22,48.26 XIO.3
PA1
  Top 0.203: IC3.77 56.3,37.63 56.77,38.1 56.77,42.93 58.67,44.83 90.81,44.83 92.96,46.99 95.25,46.99 XIO.4
PA2
  Top 0.203: XIO.5 92.71,45.72 91.31,44.32 58.93,44.32 57.28,42.67 57.28,37.85 56.8,37.37 IC3.76
PA3
  Top 0.203: XIO.6 95.25,44.45 92.2,44.45 91.57,43.81 61.98,43.81 61.34,43.18 61.34,39.26 59.44,37.35 59.44,34.67 59.11,34.35 IC3.75
PA4
  Top 0.203: IC3.74 59.75,33.85 59.94,34.04 59.94,37.23 61.85,39.13 61.85,42.8 62.36,43.31 92.58,43.31 92.71,43.18 XIO.7
PA5
  Top 0.203: IC3.73 60.02,33.35 60.45,33.78 60.45,36.97 62.36,38.88 62.36,42.29 62.87,42.8 91.57,42.8 92.46,41.91 95.25,41.91 XIO.8
PA6
  Top 0.203: IC3.72 60.28,32.85 60.96,33.53 60.96,36.72 62.87,38.62 62.87,41.91 63.25,42.29 90.81,42.29 92.46,40.64 XIO.9
PA7
  Top 0.203: IC3.71 60.54,32.35 61.47,33.27 61.47,36.47 63.37,38.37 63.37,41.4 63.75,41.78 90.04,41.78 92.46,39.37 95.25,39.37 XIO.10
PB0_SS  (via drill 0.41)
  Top 0.203: v45.47,25.91 44.88,25.35 IC3.19 41.46,25.35 41.27,25.53 38.99,25.53 38.61,25.15 37.59,25.15 v37.47,25.02 | v49.53,11.56 50.04,11.56 50.29,11.81 92.33,11.81 92.71,11.43 95.25,11.43 XIO.34 | v33.02,25.15 32.65,25.54 SJ2.3
  Bottom 0.203: v45.47,25.91 45.47,25.4 48.64,22.1 48.64,12.32 v49.53,11.56 | v37.47,25.02 33.15,25.02 v33.02,25.15
PB1_SCK  (via drill 0.41)
  Top 0.203: IC3.20 40.43,24.85 v40.51,24.77 | XIO.33 92.71,10.16 91.57,11.3 75.18,11.3 74.8,10.92 v73.91,10.92 73.53,11.3 50.67,11.3 49.66,10.29 v49.48,10.29
  Top 0.254: IC6.2 26.16,17.78 26.92,18.54 32.26,18.54 32.51,18.29 34.16,18.29 v34.42,18.54
  Bottom 0.203: v40.51,24.77 41.53,24.77 41.91,25.15 44.96,25.15 48.13,21.97 48.13,11.56 49.28,10.41 v49.48,10.29 | 63.75,27.94 64.69,27 64.69,18.31 67,16
  Bottom 0.254: 63.75,27.94 ICSP.3 | 67,16 68.83,16 v73.91,10.92 | v40.51,24.77 39.12,24.77 37.97,23.62 35.69,23.62 35.18,23.11 35.18,19.3 v34.42,18.54
PB2_MOSI  (via drill 0.41)
  Top 0.203: IC3.21 41.31,24.35 40.97,24 v39.5,24 | XIO.32 97.79,11.43 97.79,9.53 97.16,8.89 92.71,8.89 90.81,10.79 77.47,10.79 76.83,10.16 v75.82,10.16 75.69,10.03 73.66,10.03 72.9,10.79 51.47,10.79 v50.8,10.12
  Top 0.254: IC9.2 26.04,13.97 26.16,14.1 26.16,15.11 27.3,16.26 27.3,17.78 27.56,18.03 32,18.03 32.38,17.65 34.92,17.65 v35.18,17.53
  Bottom 0.203: v39.5,24 41.66,24 42.29,24.64 44.83,24.64 47.62,21.72 47.62,10.92 49.15,9.4 50.07,9.4 v50.8,10.12
  Bottom 0.254: v75.82,10.16 75.82,11.3 74.8,12.45 74.17,12.45 69.34,17.27 67.49,17.27 65.66,19.11 65.66,23.11 67.31,24.77 67.31,27.05 66.42,27.94 ICSP.4 | v39.5,24 38.61,23.11 36.07,23.11 35.69,22.73 35.69,18.03 v35.18,17.53
PB3_MISO  (via drill 0.41)
  Top 0.203: v44.58,23.62 44.35,23.85 IC3.22 41.55,23.85 40.95,23.24 37.97,23.24 36.45,24.77 v36.45,25.78 | v81.03,8.76 81.03,9.14 80.26,9.91 77.6,9.91 77.09,9.4 73.53,9.4 72.59,10.34 52.38,10.34 50.67,8.64 v50.42,8.64 | v31.37,24.26 30.73,23.6 27.05,23.6 v26.54,23.11 | U7A.15 16.13,24.52 16.13,25.27 15.75,25.65 15.24,25.65 v14.73,25.15
  Bottom 0.203: v81.03,8.76 81.15,8.76 82.93,6.99 89.66,6.99 91.19,5.46 96.9,5.46 98.3,6.86 98.3,10.29 97.16,11.43 95.25,11.43 XIO.31 | v44.58,23.62 44.96,23.62 47.12,21.46 47.12,10.79 49.28,8.64 v50.42,8.64 | ICSP.1 65.1,29.01 65.1,18.72 67.18,16.64 | v36.45,25.78 36.32,25.91 32.13,25.91 31.37,25.15 v31.37,24.26 | v14.73,25.15 15.75,24.13 19.05,24.13 20.07,25.15 21.84,25.15 23.88,23.11 v26.54,23.11
  Bottom 0.254: v81.03,8.76 81.03,9.27 80.52,9.78 77.98,9.78 77.34,9.14 75.56,9.14 74.93,9.78 74.93,11.18 74.17,11.94 73.79,11.94 69.09,16.64 67.18,16.64
PB4
  Top 0.203: IC3.23 42.9,23.35 42.93,23.37 41.76,23.37 41.25,22.86 37.59,22.86 35.69,24.77 35.69,48.51 36.58,49.4 JP1.8
PB5
  Top 0.203: IC3.24 41.97,22.85 41.48,22.35 37.34,22.35 35.18,24.51 35.18,47.75 34.04,48.9 JP1.7
PB6
  Top 0.203: IC3.25 42.92,22.35 42.93,22.35 42.16,22.35 41.66,21.84 37.08,21.84 34.67,24.26 34.67,47.24 31.75,50.16 JP1.6
PB7  (via drill 0.41)
  Top 0.203: IC3.26 44.22,20.34 43.71,19.84 34.57,19.84 v34.29,20.19 | JP1.5 28.96,50.29 30.1,49.15 32,49.15 34.16,46.99 v34.16,23.11
  Top 0.254: v13.59,46.48 10.79,46.48 10.36,46.92 IC1.3
  Bottom 0.203: v34.29,20.19 34.29,22.48 34.16,22.61 v34.16,23.11
  Bottom 0.254: JP1.5 28.96,48.64 28.7,48.39 28.19,48.39 25.53,45.72 24.77,45.72 21.84,48.64 14.86,48.64 13.59,47.37 v13.59,46.48
PC0
  Top 0.203: IC3.53 61.49,23.35 62.74,22.1 81.53,22.1 88.65,29.21 95.25,29.21 XIO.18
PC1
  Top 0.203: IC3.54 61.75,23.85 62.87,22.61 80.9,22.61 88.77,30.48 XIO.17
PC2
  Top 0.203: IC3.55 62.01,24.35 63.12,23.24 68.33,23.24 70.1,25.02 82.17,25.02 88.9,31.75 95.25,31.75 XIO.16
PC3
  Top 0.203: IC3.56 62.28,24.85 63.37,23.75 68.2,23.75 69.98,25.53 81.53,25.53 89.03,33.02 XIO.15
PC4
  Top 0.203: IC3.57 61.92,25.35 63.04,26.47 67.36,26.47 69.47,28.57 83.57,28.57 89.28,34.29 95.25,34.29 XIO.14
PC5
  Top 0.203: IC3.58 61.66,25.85 62.69,26.87 67,26.87 69.09,29.08 83.06,29.08 89.66,35.56 XIO.13
PC6
  Top 0.203: IC3.59 61.52,26.35 62.48,27.3 62.48,28.7 62.79,29.01 68.28,29.01 68.86,29.59 82.68,29.59 89.92,36.83 95.25,36.83 XIO.12
PC7
  Top 0.203: IC3.60 61.39,26.85 61.98,27.43 61.98,28.83 62.56,29.41 67.87,29.41 68.56,30.1 82.3,30.1 90.3,38.1 XIO.11
PD7
  Top 0.203: XIO.19 88.52,27.94 82.17,21.59 60.3,21.59 60.3,21.57 59.69,20.95 59.69,20.57 58.17,19.05 58.04,19.05 57.4,18.41 56.9,18.41 56.8,18.51 IC3.50
PE0  (via drill 0.41)
  Top 0.203: PWML.1 61.47,48.77 59.44,48.77 57.78,47.12 52.83,47.12 51.18,45.47 45.21,45.47 44.45,44.7 41.27,44.7 40.77,44.2 40.77,36.7 v41.15,36.32 41.15,35.94 42.16,34.92 43.69,34.92 43.94,34.67 43.94,34.04 43.75,33.85 IC3.2
  Top 0.254: RN5.2 28.63,31.11 28.96,31.11 30.86,33.02 30.86,34.67 v31.62,35.43
  Bottom 0.254: v31.62,35.43 39.5,35.43 40.39,36.32 v41.15,36.32
PE1  (via drill 0.41)
  Top 0.203: v40.64,35.05 40.26,35.31 40.26,44.58 41.02,45.34 44.32,45.34 44.96,45.97 50.8,45.97 52.45,47.62 57.53,47.62 59.18,49.28 59.69,49.28 60.96,50.55 PWML.2 | v40.64,33.27 40.51,33.27 40.71,33.35 IC3.3
  Top 0.254: RN5.1 29.03,30.3 31.88,33.15 v31.88,34.04
  Bottom 0.254: v40.64,35.05 v40.64,33.27 39.12,34.8 32.77,34.8 32,34.04 v31.88,34.04
PE3  (via drill 0.41)
  Top 0.203: IC3.5 40.17,32.35 39.24,33.27 39.24,44.96 40.77,46.48 43.94,46.48 44.7,47.24 v46.99,47.24
  Bottom 0.203: v46.99,47.24 47.75,47.24 50.8,50.29 PWML.6
PE4
  Top 0.203: IC3.6 39.91,31.85 38.73,33.02 38.73,45.09 40.64,46.99 43.69,46.99 44.83,48.13 47.37,48.13 47.75,48.51 57.53,48.51 58.42,49.28 PWML.3
PE5
  Top 0.203: IC3.7 42.78,31.35 42.55,31.37 39.75,31.37 38.23,32.89 38.23,45.21 40.51,47.5 43.43,47.5 44.58,48.64 46.99,48.64 47.37,49.02 55.24,49.02 55.88,49.53 PWML.4
PE6  (via drill 0.41)
  Top 0.203: 38.5,31.35 v38.48,31.37 39,30.85 IC3.8 | v32.51,29.46 31.58,29.46 SJ3.3
  Bottom 0.203: v38.48,31.37 36.96,31.37 34.8,29.21 32.77,29.21 v32.51,29.46
PG0  (via drill 0.41)
  Top 0.203: IC3.51 58.8,21.84 v59.05,21.46 | XIO.22 95.25,24.13 88.14,24.13 84.07,20.07 71.75,20.07 70.1,18.41 59.69,18.41 59.44,18.67 v59.05,18.67
  Bottom 0.203: v59.05,18.67 v59.05,21.46
PG1  (via drill 0.41)
  Top 0.203: IC3.52 60.44,22.85 v60.83,22.48 | XIO.21 88.27,25.4 83.44,20.57 71.12,20.57 69.6,19.05 60.33,19.05 59.94,19.43 v59.94,19.56
  Bottom 0.203: v59.94,19.56 60.58,19.56 61.34,20.32 61.34,21.97 v60.83,22.48
PG2  (via drill 0.41)
  Top 0.203: IC3.70 59.8,31.85 59.92,31.73 59.92,29.49 v60.33,29.08 | v60.58,20.7 61.09,20.7 61.47,21.08 82.8,21.08 88.39,26.67 95.25,26.67 XIO.20
  Bottom 0.203: v60.58,20.7 60.2,20.7 59.94,20.95 59.94,28.57 v60.33,29.08
PG5  (via drill 0.41)
  Top 0.203: IC3.1 42.73,34.35 42.67,34.29 40.13,34.29 39.75,34.67 39.75,44.83 40.89,45.97 44.2,45.97 44.7,46.48 48.77,46.48 v49.53,47.24
  Bottom 0.203: PWML.5 53.34,50.55 50.04,47.24 v49.53,47.24
PH3
  Top 0.203: IC3.15 38.31,27.35 37.72,27.94 37.72,45.34 40.39,48.01 43.18,48.01 44.32,49.15 46.61,49.15 PWML.7
PH4  (via drill 0.41)
  Top 0.203: PWML.8 45.21,50.8 42.93,48.51 40.26,48.51 37.21,45.47 37.21,27.69 38.05,26.85 IC3.16 44.53,26.85 v44.58,26.8 | SJ1.1 29.86,21.84 30.86,21.84 v31.5,21.21
  Bottom 0.203: v31.5,21.21 31.24,21.46 31.24,22.86 32.51,24.13 37.72,24.13 39.37,25.78 43.56,25.78 v44.58,26.8
PH5
  Top 0.203: IC3.17 37.79,26.35 36.7,27.43 36.7,45.72 40.01,49.02 40.77,49.02 41.66,49.91 JP1.10
PH6
  Top 0.203: IC3.18 42.73,25.85 42.67,25.91 37.47,25.91 36.2,27.18 36.2,46.1 39.12,49.02 JP1.9
PH7  (via drill 0.41)
  Top 0.203: v32.13,22.48 31.41,22.94 SJ2.1 | v33.4,19.3 44.2,19.3 44.45,19.05 45.09,19.05 45.3,19.27 IC3.27
  Bottom 0.203: v32.13,22.48 33.15,21.46 33.15,19.56 v33.4,19.3
PJ2
  Top 0.203: IC3.65 57.52,29.35 56.52,30.35 56.52,31.37 56.13,31.75 55.24,31.75 54.36,30.86 54.36,25.15 52.45,23.24 47.62,23.24 45.97,21.59 44.7,21.59 43.43,20.32 36.07,20.32 35.31,21.08 33.91,21.08 32.09,19.26 SJ1.3
PJ6
  Top 0.203: IC3.69 57.68,31.35 57.53,31.5 57.53,31.62 56.39,32.77 54.99,32.77 53.34,31.11 53.34,25.53 52.07,24.26 47.37,24.26 45.72,22.61 44.45,22.61 43.18,21.34 36.58,21.34 35.69,22.23 33.78,22.23 33.4,22.61 33.4,24.26 33.78,24.64 33.78,25.53 32.64,26.67 31.64,26.67 SJ3.1
PL0
  Top 0.203: 49.28,20.3 49.28,17.91 54.86,12.32 90.3,12.32 91.95,13.97 95.25,13.97 XIO.30
  Top 0.254: IC3.35 49.3,20.32 49.28,20.3
PL1
  Top 0.203: IC3.36 49.8,18.02 54.99,12.83 89.53,12.83 91.95,15.24 XIO.29
PL2
  Top 0.203: 50.29,20.3 50.29,18.16 55.12,13.34 88.9,13.34 92.08,16.51 95.25,16.51 XIO.28
  Top 0.254: IC3.37 50.27,20.32 50.29,20.3
PL3
  Top 0.203: IC3.38 50.8,18.29 55.24,13.84 88.27,13.84 92.2,17.78 XIO.27
PL4
  Top 0.203: 51.31,20.22 51.31,18.41 55.37,14.35 87.63,14.35 92.33,19.05 95.25,19.05 XIO.26
  Top 0.254: IC3.39 51.3,20.28 51.33,20.24 51.31,20.22
PL5
  Top 0.203: IC3.40 51.8,18.56 55.5,14.86 87,14.86 92.46,20.32 XIO.25
PL6
  Top 0.203: 52.32,20.24 52.32,18.67 55.63,15.37 86.49,15.37 92.71,21.59 95.25,21.59 XIO.24
  Top 0.254: IC3.41 52.3,20.32 52.27,20.3 52.32,20.24
PL7
  Top 0.203: IC3.42 52.8,18.83 55.75,15.88 85.72,15.88 92.71,22.86 XIO.23
RD+
  Top 0.254: RN4.4 13.4,39.3 13.97,38.74 IC4.29
RD-
  Top 0.254: RN4.1 12.77,36.87
  Top 0.305: IC4.30 15,38.24 13.66,36.9 RN4.1
RESET  (via drill 0.41)  (1 unrouted)
  Top 0.254: 64.72,24.31 68.12,24.31 69.85,26.04 78.74,26.04 v80.01,27.3 | 46.8,18.94 45.47,17.6 45.47,16.38 46.86,14.99 RESET-EN.1 RESET-EN.2 | POWER.3 33.02,1.65 33.78,0.89 41.53,0.89 41.91,1.27 41.91,3.94 42.67,4.7 44.07,4.7 46.61,7.24 47.37,7.24 v47.43,7.3 | RESET.3 77.72,23.74 v78.87,23.75 | D5.A 82.34,35.35 82.3,35.4 82.3,36.96 82.02,37.23 RN1.7
  Top 0.305: 46.8,18.94 IC3.30 | ICSP.5 64.72,24.31 | v78.61,8.76 78.49,8.64 73.28,8.64 72.08,9.83 52.81,9.83 50.55,7.62 v50.04,7.11 | RESET.4 v80.01,32.13 81.41,32.13 82.42,33.15 82.42,33.83 | RESET-EN.2 C10.2 | RESET-EN.1 46.74,13.46 46.74,12.95 C1.1 47.75,11.94 47.75,7.62 v47.43,7.3
  Bottom 0.254: 63.75,25.27 64.14,24.89 64.14,17.91 66.67,15.37 | v78.87,23.75 78.87,25.27 79.5,25.91 79.5,26.8 v80.01,27.3
  Bottom 0.305: v78.61,8.76 78.11,8.76 77.98,8.64 74.93,8.64 68.2,15.37 66.67,15.37 | 63.75,25.27 ICSP.5 | v80.01,27.3 v80.01,32.13 | v50.04,7.11 47.62,7.11 v47.43,7.3
RESET2
  Top 0.203: RN3.8 8.19,48.95 8.31,49.07 10.97,49.07 11.94,49.91 12.83,49.91 13.46,49.28 13.46,48.9 14.35,48.01 14.61,48.01 15.11,47.5 ICSP1.5
  Top 0.305: 17.17,43.31 17.17,43.91 17.02,44.07 17.02,46.23 ICSP1.5 | 17.17,43.31 IC4.24 | D4.A 16.79,42.93 17.17,43.31
RST_3V3  (via drill 0.41)
  Top 0.254: IC5.4 23.1,20.97 22.5,21.57 v22.5,23.11 | v20.45,24.26 20.32,24.26 19.3,23.24 18.03,23.24 17.65,23.63 U7A.12
  Bottom 0.254: v20.45,24.26 21.36,24.26 v22.5,23.11
RST_5V
  Top 0.203: RN6.4 26.6,26.61 | 27.3,24.89 30.61,24.89 30.86,25.15 31.75,25.15 32,24.89 33.02,23.75 33.02,21.59 31.75,20.32 30.24,20.32 SJ1.2 29.48,20.56 28.7,21.34 28.45,21.34 27.81,21.97 26.54,21.97 26.16,21.59 26.16,20.57 25.91,20.32 IC5.2
  Top 0.254: 27.3,24.89 26.67,25.53 26.67,25.65 26.6,25.72 RN6.4
RXD1  (via drill 0.41)
  Top 0.203: IC3.45 54.33,20.35 54.36,20.32 54.36,19.18 56.19,17.35 71.96,17.35 v72.64,17.91
  Bottom 0.203: COMMUNICATION.3 81.28,42.67 74.04,35.43 74.04,19.3 v72.64,17.91
RXD2  (via drill 0.41)
  Top 0.203: IC3.12 41.04,28.85 v41.02,28.57
  Bottom 0.203: v41.02,28.57 41.02,29.34 43.05,31.37 43.05,37.21 43.69,37.85 43.69,40.89 44.58,41.78 44.58,44.83 45.09,45.34 50.55,45.34 51.82,46.61 58.04,46.61 59.44,45.21 60.78,45.21 64.85,49.28 67.13,49.28 68.28,48.13 75.06,48.13 76.2,49.28 COMMUNICATION.5
RXD3  (via drill 0.41)
  Top 0.203: COMMUNICATION.7 71.12,49.53 70.36,48.77 67.69,48.77 66.8,47.75 v66.67,47.37 | v55.37,29.59 55.63,29.59 56.9,28.32 58.8,28.32 IC3.63
  Bottom 0.203: v66.67,47.37 66.67,46.86 55.7,35.76 55.7,32.18 56.52,31.37 56.52,30.23 55.88,29.59 v55.37,29.59
RXL
  Top 0.254: IC4.10 21.82,37.74 25.27,34.29 RX.C
SCK2
  Top 0.254: ICSP1.3 19.43,48.64 21.72,48.64 22.86,47.5 22.86,42.04 22.07,41.25 22.07,40.49 21.85,40.26 IC4.15
SCK_3V3
  Top 0.254: U7A.13 17.15,25.4 17.4,25.65 20.83,25.65 21.72,24.89 21.72,21.46 22.73,20.45 22.73,18.67 22.99,18.41 23.39,18.41 IC6.4
SCL  (via drill 0.41)
  Top 0.203: IC3.43 53.3,18.96 55.88,16.38 74.8,16.38 v75.31,16.89 | v45.59,43.31 43.18,43.31 v42.42,42.55 | v33.4,44.2 33.15,44.2 32.64,44.7 32.64,46.86 31.37,48.13 23.11,48.13 22.1,49.15 20.45,49.15 JP1.1
  Top 0.305: RN1.8 81.32,39.03 v81.41,39.12
  Bottom 0.203: COMMUNICATION.1 86.36,50.42 82.55,46.61 82.55,41.91 81.41,40.77 v81.41,39.12 80.01,39.12 75.31,34.42 v75.31,16.89 74.8,16.38 72.26,16.38 70.87,17.78 70.87,44.32 66.93,48.26 65.15,48.26 60.83,43.94 59.18,43.94 57.66,45.47 52.2,45.47 51.05,44.32 46.61,44.32 v45.59,43.31 | v42.42,42.55 42.04,42.55 41.27,43.31 41.27,43.43 40.39,44.32 33.91,44.32 v33.4,44.2
SDA  (via drill 0.41)
  Top 0.203: IC3.44 53.8,20.14 53.8,20.04 53.85,19.94 53.85,19.05 56.01,16.89 73.28,16.89 v74.04,17.65 | v45.47,44.58 45.34,44.58 44.58,43.81 v42.29,43.81 | v33.4,45.47 33.4,46.86 31.62,48.64 23.5,48.64 JP1.2
  Top 0.305: v78.74,38.99 78.74,36.83 79.12,36.45 79.95,36.45 RN1.3
  Bottom 0.203: COMMUNICATION.2 83.82,49.02 81.92,47.12 81.92,42.16 v78.74,38.99 74.68,34.92 74.68,18.29 v74.04,17.65 73.28,16.89 72.52,16.89 71.37,18.03 71.37,40.51 | 71.37,44.45 67.06,48.77 65.02,48.77 60.83,44.58 59.31,44.58 57.91,45.97 51.94,45.97 50.8,44.83 45.72,44.83 v45.47,44.58 | v42.29,43.81 42.29,44.45 41.78,44.96 33.91,44.96 v33.4,45.47
  Bottom 0.254: 71.37,44.45 71.37,40.51
SS_3V3
  Top 0.254: U7A.14 16.65,25.79 17.02,26.16 21.59,26.16 22.97,24.78 IC8.4
SS_MAX5
  Top 0.203: SJ2.2 27.32,24.24 27.18,24.26
  Top 0.254: RN6.2 25,26.31 26.29,25.02 26.29,24.13 | 27.18,24.26 27.05,24.13 26.29,24.13 | IC8.2 26.29,24.13
SW
  pour Top (no thermals): 34.29,14.22 36.2,14.22 36.2,17.4 38.73,17.4 38.73,12.45 37.72,11.43 32.38,11.43 32.38,12.95 34.29,12.95
TXD1  (via drill 0.41)
  Top 0.203: IC3.46 54.8,20.26 54.86,20.19 54.86,19.3 56.26,17.91 71.25,17.91 v72.52,19.18
  Bottom 0.203: COMMUNICATION.4 78.74,42.67 73.41,37.34 73.41,19.94 72.64,19.18 v72.52,19.18
TXD2  (via drill 0.41)
  Top 0.203: IC3.13 41.94,28.35 41.4,27.81 40.01,27.81 39.75,28.07 v39.75,28.57
  Bottom 0.203: v39.75,28.57 39.75,28.96 42.55,31.75 42.55,37.34 43.18,37.97 43.18,41.15 44.07,42.04 44.07,45.09 44.83,45.85 50.29,45.85 51.69,47.24 58.17,47.24 59.69,45.72 60.71,45.72 64.77,49.78 67.21,49.78 68.35,48.64 72.77,48.64 73.66,49.53 COMMUNICATION.6
TXD3  (via drill 0.41)
  Top 0.203: COMMUNICATION.8 68.33,50.8 66.42,48.9 66.42,48.39 v65.41,47.37 | IC3.64 58.66,28.85 58.55,28.83 57.4,28.83 56.01,30.23 56.01,30.48 v55.63,30.86
  Bottom 0.203: v65.41,47.37 65.41,46.35 55.22,36.14 55.22,31.27 v55.63,30.86
TXL
  Top 0.254: 26.8,36.83 TX.C 26.76,36.7 23.62,36.7 22.09,38.24 IC4.11
UGND
  Top 0.305: IC4.28 14.74,39.24 14.35,39.62
  Top 0.61: L2.1 9.14,45.21 10.79,43.56 11.01,43.56 C16.2 11.18,42.65 11.73,42.09 13.89,42.09 14.35,41.63 14.35,39.62
  Top 0.813: X2.4 6.5,36.83 5.08,36.83 4.45,37.47 4.45,39.75 8.13,43.43 8.13,45.17 L2.1
  Bottom 0.813: X2.4 6.52,36.53 GROUND.1
USBVCC  (via drill 0.41)
  Top 0.305: IC4.31 15.39,37.74 14.61,36.96
  Top 0.406: 14.61,34.92 14.61,36.96
  Top 0.508: v3.05,49.53 F1.1 3.12,51.28 T1.1 | v9.65,30.99 9.91,30.99 9.91,32.38 10.41,32.89 C11.1 12.06,33.4 12.83,34.16 13.84,34.16 14.61,34.92
  Bottom 0.508: v3.05,49.53 3.05,46.86 1.52,45.34 1.52,41.91 3.56,39.88 3.56,38.23 1.52,36.2 1.52,27.43 2.54,26.42 5.08,26.42 v9.65,30.99
USHIELD  (via drill 0.41)
  Top 0.61: 4.06,24.77 4.14,24.49 8.59,24.49 9.02,24.89 11.05,24.89 11.56,24.38 11.56,23.64 Z4.1 | Z3.1 11.54,17.89 10.67,17.02 5.17,17.02 X3.S2
  Top 0.813: Z2.1 10.18,41.26 10.05,41.26 9.65,41.66 v9.65,42.67 | L2.2 4.92,45.21 X2.P$1 | 3.81,33.02 5.08,33.02 5.71,33.66 6.99,33.66 8.64,35.31 Z1.1 | Z3.1 11.56,18.27
  Top 1.27: 3.81,33.02 X2.P$2 3.81,30.48 4.06,30.23 X3.S1 4.06,24.77 X3.S2
  Bottom 0.813: v9.65,42.67 5.49,42.67 X2.P$1
  Bottom 1.27: X2.P$2 3.81,33.91 4.83,34.92 4.83,40.89 3.81,41.91 X2.P$1
VIN  (via drill 0.41)
  Top 0.203: RN3.6 6.99,47.35 6.73,47.1 6.73,46.1 7.11,45.72 7.11,43.69 v2.41,39.12
  Top 0.305: v2.79,11.43 9.26,11.43 11.68,9 X1.2
  Top 0.406: IC2.5 31.62,11.3 31.24,10.92 30,10.92 C4.+
  Top 0.61: R1.1 27.46,8.64 C4.+
  Top 0.813: R1.1 26.04,8.13 26.04,8 24.51,6.48 19.99,6.48 19.96,6.5 v19.56,6.1 | X1.2 13.07,9.69 17.65,9.69 | D2.C 19.26,5.8 v19.56,6.1 | 17.65,9.69 20.05,9.69 PC1.+ 20.57,8.99 20.57,7.11 v19.56,6.1 | 17.65,9.69 C3.1
  Bottom 0.203: v2.41,39.12 0.89,37.59 0.89,13.34 v2.79,11.43
  Bottom 1.016: POWER.8 45.72,4.57 43.81,6.48 31.62,6.48 29.84,4.7 20.95,4.7 v19.56,6.1
VUCAP
  Top 0.305: C16.1 13.17,43.43 13.72,43.43 15.11,42.04 15.11,40.13 15.51,39.74 IC4.27
XT1
  Top 0.305: IC4.1 17.17,35.21 17.02,35.05 17.02,33.44 Y2.1 16.52,33.53 15.88,32.89 C13.1
XT2  (1 unrouted)
  Top 0.203: 17.91,32.26 17.91,34.54
  Top 0.305: IC4.2 17.67,34.82 17.91,34.54 | 18.8,31.37 17.91,32.26 | C12.1 18.95,31.11 Y2.3
XTAL1
  Top 0.203: Y1.3 50.8,14.24 50.8,15.49 48.8,17.49 IC3.34
XTAL2
  Top 0.203: IC3.33 48.3,17.02 48.78,16.61 Y1.1
XVCC
  Top 0.508: X2.1 6.85,35.18 3.94,35.18 1.4,37.72 1.4,46.48 2.5,47.58 F1.2

## Text on the board
Top: MEGAADK_REV3b | ARDUINO MEGA2560 ADK (for Android) REV3 | Reference Designs ARE PROVIDED "AS IS" AND "WITH ALL FAULTS. Arduino DISCLAIMS ALL OTHER WARRANTIES, EXPRESS OR IMPLIED, | REGARDING PRODUCTS, INCLUDING BUT NOT LIMITED TO, ANY IMPLIED WARRANTIES OF MERCHANTABILITY OR FITNESS FOR A PARTICULAR PURPOSE | Arduino may make changes to specifications and product descriptions at any time, without notice. The Customer must not | rely on the absence or characteristics of any features or instructions marked "reserved" or "undefined." Arduino reserves | these for future definition and shall have no responsibility whatsoever for conflicts or incompatibilities arising from future changes to them. | The product information on the Web Site or Materials is subject to change without notice. Do not finalize a design with this information. | ARDUINO is a registered trademark. | Android is a trademark of Google Inc. Use of this trademark is subject to Google Permissions
tNames: M.Banzi | 5V | D.Cuartielles | T.Igoe | G.Martino | 9 | 8 | 7 | 6 | 5 | 4 | 3 | 2 | 1 | 0 | 22 | 14 | 15 | 16 | 17 | 18 | 19 | 20 | 21 | D.Mellis | 13 | 12 | 11 | 10 | GND | 24 | AREF | PWM | 26 | TX | RX | TX3 | RX3 | TX2 | RX2 | TX1 | RX1 | SDA | SCL | 28 | 30 | 31 | 32 | 33 | MADE IN | 34 | 35 | 1 | 36 | 37 | 38 | 39 | 40 | 41 | ITALY | DIGITAL | 42 | 43 | www.arduino.cc | 44 | 45 | 46 | 47 | TM | 48 | 49 | Arduino | MISO | MOSI | MEGA 2560 ADK | TM | SCK | SS | for Android | ANALOG IN | 0 | 1 | 2 | 3 | 4 | 5 | 6 | 7 | 8 | 9 | 10 | 11 | 12 | 13 | 14 | 15 | GND | IOREF | RESET | 3V3 | 5V | GND | GND | VIN
bNames: MADE IN | designed by | ITALY | tinker it